# EAGLE schematic Powerboard v1 (EAGLE 9.4.2)
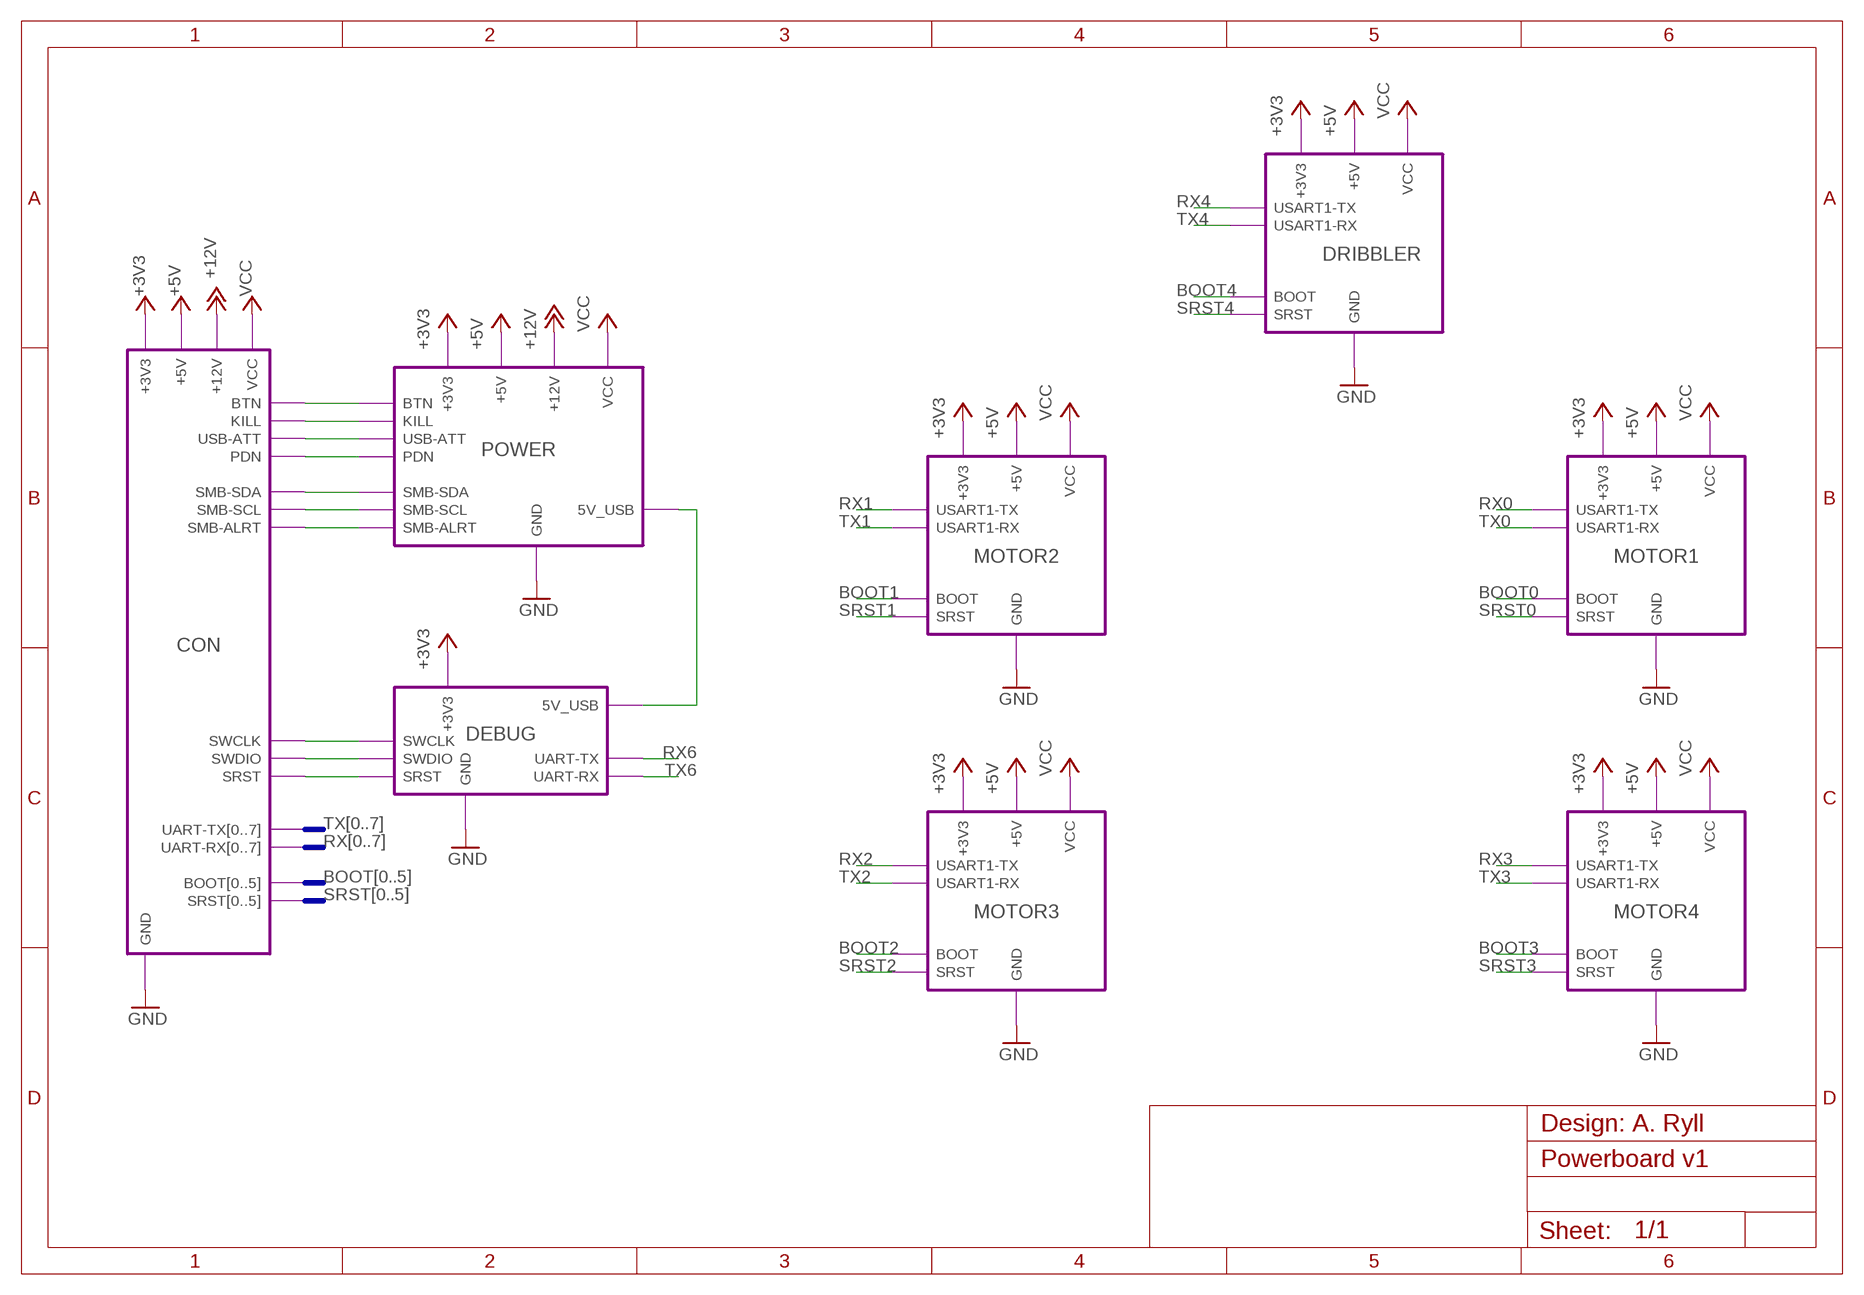
[diagram p0: schematic, sheet 1]

## Module instances
POWER = POWER
DEBUG = DEBUG
MOTOR1 = MOTOR
MOTOR2 = MOTOR
CON = CON
MOTOR3 = MOTOR
MOTOR4 = MOTOR
DRIBBLER = DRIBBLER

## Nets
5V_USB: port POWER.5V_USB DEBUG.5V_USB
+3V3: port POWER.+3V3 MOTOR2.+3V3 MOTOR3.+3V3 MOTOR1.+3V3 MOTOR4.+3V3 DRIBBLER.+3V3 DEBUG.+3V3 CON.+3V3
+5V: port POWER.+5V MOTOR2.+5V MOTOR3.+5V MOTOR1.+5V MOTOR4.+5V DRIBBLER.+5V CON.+5V
+12V: port POWER.+12V CON.+12V
BOOT0: port MOTOR1.BOOT
BOOT1: port MOTOR2.BOOT
BOOT2: port MOTOR3.BOOT
BOOT3: port MOTOR4.BOOT
BOOT4: port DRIBBLER.BOOT
BTN: port CON.BTN POWER.BTN
GND: port CON.GND POWER.GND MOTOR1.GND MOTOR2.GND MOTOR3.GND MOTOR4.GND DRIBBLER.GND DEBUG.GND
KILL: port CON.KILL POWER.KILL
PDN: port CON.PDN POWER.PDN
RX0: port MOTOR1.USART1-TX
RX1: port MOTOR2.USART1-TX
RX2: port MOTOR3.USART1-TX
RX3: port MOTOR4.USART1-TX
RX4: port DRIBBLER.USART1-TX
RX6: port DEBUG.UART-TX
SMB-ALRT: port CON.SMB-ALRT POWER.SMB-ALRT
SMB-SCL: port CON.SMB-SCL POWER.SMB-SCL
SMB-SDA: port CON.SMB-SDA POWER.SMB-SDA
SRST: port CON.SRST DEBUG.SRST
SRST0: port MOTOR1.SRST
SRST1: port MOTOR2.SRST
SRST2: port MOTOR3.SRST
SRST3: port MOTOR4.SRST
SRST4: port DRIBBLER.SRST
SWCLK: port CON.SWCLK DEBUG.SWCLK
SWDIO: port CON.SWDIO DEBUG.SWDIO
TX0: port MOTOR1.USART1-RX
TX1: port MOTOR2.USART1-RX
TX2: port MOTOR3.USART1-RX
TX3: port MOTOR4.USART1-RX
TX4: port DRIBBLER.USART1-RX
TX6: port DEBUG.UART-RX
USB-ATT: port CON.USB-ATT POWER.USB-ATT
VCC: port POWER.VCC MOTOR2.VCC MOTOR3.VCC MOTOR1.VCC MOTOR4.VCC DRIBBLER.VCC CON.VCC

## Buses
SRST[0..5]
BOOT[0..5]
TX[0..7]
RX[0..7]

## Notes on the sheet
- Design: A. Ryll

## Library data of the parts

## Module POWER
Ports: SMB-SCL(in) SMB-SDA(io) USB-ATT(out) PDN(out) KILL(in) 5V_USB(pwr) +3V3(pwr) +5V(pwr) +12V(pwr) VCC(pwr) GND(pwr) SMB-ALRT(oc) BTN(in)
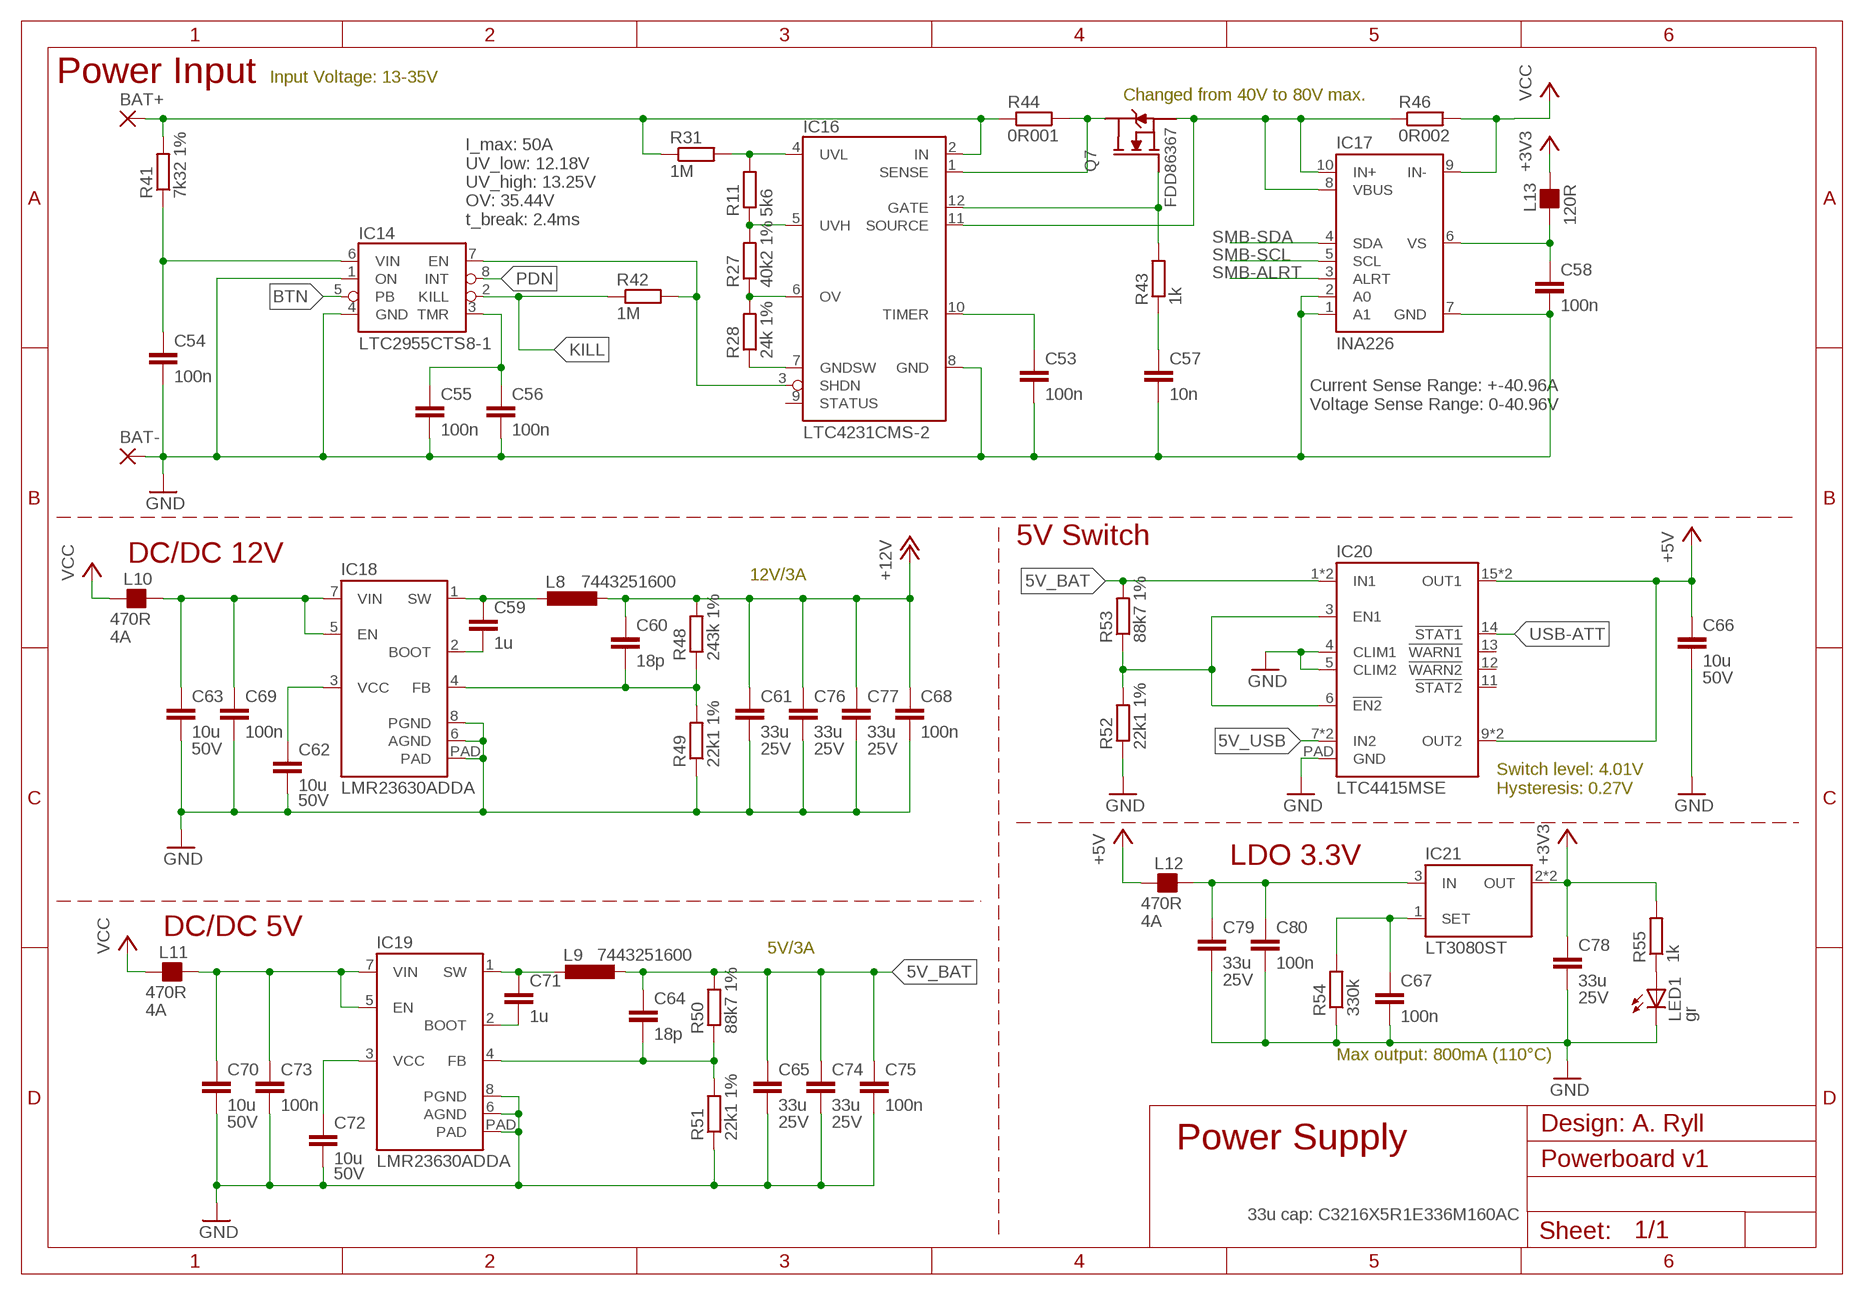
[diagram p1: schematic, module POWER, sheet 1]

### Parts
BAT+  WIREPAD5,08/3  [5,08/3]
BAT-  WIREPAD5,08/3  [5,08/3]
C53  100n  C-EUC0603  [C0603]
C54  100n  C-EUC0603  [C0603]
C55  100n  C-EUC0603  [C0603]
C56  100n  C-EUC0603  [C0603]
C57  10n  C-EUC0603  [C0603]
C58  100n  C-EUC0603  [C0603]
C59  1u  C-EUC0603  [C0603]
C60  18p  C-EUC0603  [C0603]
C61  33u  C-EUC1206  [C1206]
C62  10u  C-EUC1206  [C1206]
C63  10u  C-EUC1206  [C1206]
C64  18p  C-EUC0603  [C0603]
C65  33u  C-EUC1206  [C1206]
C66  10u  C-EUC1206  [C1206]
C67  100n  C-EUC0603  [C0603]
C68  100n  C-EUC0603  [C0603]
C69  100n  C-EUC0603  [C0603]
C70  10u  C-EUC1206  [C1206]
C71  1u  C-EUC0603  [C0603]
C72  10u  C-EUC1206  [C1206]
C73  100n  C-EUC0603  [C0603]
C74  33u  C-EUC1206  [C1206]
C75  100n  C-EUC0603  [C0603]
C76  33u  C-EUC1206  [C1206]
C77  33u  C-EUC1206  [C1206]
C78  33u  C-EUC1206  [C1206]
C79  33u  C-EUC1206  [C1206]
C80  100n  C-EUC0603  [C0603]
IC14  LTC2955CTS8-1  LTC2955  [SOT23-8]
IC16  LTC4231CMS-2  LTC4231  [MSOP-12]
IC17  INA226  [DGS_S-PDSO-G10]
IC18  LMR23630ADDA  LMR23630_DDA  [DDA_R-PDSO-G8]
IC19  LMR23630ADDA  LMR23630_DDA  [DDA_R-PDSO-G8]
IC20  LTC4415MSE  [MSOP-16P]
IC21  LT3080ST  [SOT223]
L8  7443251600  LHCI  [WE-HCI]
L9  7443251600  LHCI  [WE-HCI]
L10  470R  FB_1206  [L1206]
L11  470R  FB_1206  [L1206]
L12  470R  FB_1206  [L1206]
L13  120R  FB_0603  [L0603]
LED1  gr  LEDCHIP-LED0603  [CHIP-LED0603]
Q7  FDD86367  NMOSDPAK  [D-PAK_TO252AA]
R11  5k6  R-EU_R0603  [R0603]
R27  40k2 1%  R-EU_R0603  [R0603]
R28  24k 1%  R-EU_R0603  [R0603]
R31  1M  R-EU_R0603  [R0603]
R41  7k32 1%  R-EU_R0603  [R0603]
R42  1M  R-EU_R0603  [R0603]
R43  1k  R-EU_R0603  [R0603]
R44  0R001  R-EU_R2512  [R2512]
R46  0R002  R-EU_R2512  [R2512]
R48  243k 1%  R-EU_R0603  [R0603]
R49  22k1 1%  R-EU_R0603  [R0603]
R50  88k7 1%  R-EU_R0603  [R0603]
R51  22k1 1%  R-EU_R0603  [R0603]
R52  22k1 1%  R-EU_R0603  [R0603]
R53  88k7 1%  R-EU_R0603  [R0603]
R54  330k  R-EU_R0603  [R0603]
R55  1k  R-EU_R0603  [R0603]

### Nets
5V_BAT: C64.1 C65.1 C74.1 C75.1 IC20.1(IN1) IC20.2(IN1) L9.1 R50.2 R53.2
5V_USB: IC20.7(IN2) IC20.8(IN2)
+3V3: C78.1 IC21.2(OUT) IC21.4(OUT) L13.2 R55.2
+5V: C66.1 IC20.9(OUT2) IC20.10(OUT2) IC20.15(OUT1) IC20.16(OUT1) L12.1
+12V: C60.1 C61.1 C68.1 C76.1 C77.1 L8.1 R48.2
BTN: IC14.5(PB)
GND: BAT-.P$1(P) C53.2 C54.2 C55.2 C56.2 C57.2 C58.2 C61.2 C62.2 C63.2 C65.2 C66.2 C67.2 C68.2 C69.2 C70.2 C72.2 C73.2 C74.2 C75.2 C76.2 C77.2 C78.2 C79.2 C80.2 IC14.1(ON) IC14.4(GND) IC16.8(GND) IC17.1(A1) IC17.2(A0) IC17.7(GND) IC18.6(AGND) IC18.8(PGND) IC18.PAD IC19.6(AGND) IC19.8(PGND) IC19.PAD IC20.4(CLIM1) IC20.5(CLIM2) IC20.PAD(GND) LED1.C R49.1 R51.1 R52.1 R54.1
KILL: IC14.2(KILL) R42.1
N$33: C53.1 IC16.10(TIMER)
N$73: IC16.5(UVH) R11.1 R27.2
N$74: IC16.6(OV) R27.1 R28.2
N$75: IC16.4(UVL) R11.2 R31.2
N$76: IC16.7(GNDSW) R28.1
N$77: C54.1 IC14.6(VIN) R41.1
N$79: C55.1 C56.1 IC14.3(TMR)
N$80: IC14.7(EN) IC16.3(SHDN) R42.2
N$81: C57.1 R43.1
N$82: IC16.1(SENSE) Q7.4(D) R44.2
N$83: IC16.12(GATE) Q7.1(G) R43.2
N$84: IC16.11(SOURCE) IC17.8(VBUS) IC17.10(IN+) Q7.3(S) R46.1
N$98: C62.1 IC18.3(VCC)
N$99: C59.1 IC18.1(SW) L8.2
N$100: C60.2 IC18.4(FB) R48.1 R49.2
N$101: C59.2 IC18.2(BOOT)
N$102: C72.1 IC19.3(VCC)
N$103: C71.1 IC19.1(SW) L9.2
N$104: C64.2 IC19.4(FB) R50.1 R51.2
N$105: C71.2 IC19.2(BOOT)
N$106: IC20.3(EN1) IC20.6(!EN2) R52.2 R53.1
N$107: C67.1 IC21.1(SET) R54.2
N$108: LED1.A R55.1
N$109: C63.1 C69.1 IC18.5(EN) IC18.7(VIN) L10.2
N$110: C70.1 C73.1 IC19.5(EN) IC19.7(VIN) L11.2
N$111: C79.1 C80.1 IC21.3(IN) L12.2
N$112: C58.1 IC17.6(VS) L13.1
PDN: IC14.8(INT)
SMB-ALRT: IC17.3(ALRT)
SMB-SCL: IC17.5(SCL)
SMB-SDA: IC17.4(SDA)
USB-ATT: IC20.14(!STAT1)
V_BAT: BAT+.P$1(P) IC16.2(IN) R31.1 R41.2 R44.1
VCC: IC17.9(IN-) L10.1 L11.1 R46.2
Unconnected: IC16.9(STATUS) IC20.11(!STAT2) IC20.12(!WARN2) IC20.13(!WARN1)

### Notes on the sheet
- Power Input | Input Voltage: 13-35V
- Changed from 40V to 80V max.
- I_max: 50A
  UV_low: 12.18V
  UV_high: 13.25V
  OV: 35.44V
  t_break: 2.4ms
- Current Sense Range: +-40.96A
  Voltage Sense Range: 0-40.96V
- 5V Switch
- DC/DC 12V
- 12V/3A
- Switch level: 4.01V
  Hysteresis: 0.27V
- LDO 3.3V
- DC/DC 5V
- 5V/3A
- Max output: 800mA (110°C)
- Design: A. Ryll
- Power Supply
- 33u cap: C3216X5R1E336M160AC

### Library data of the parts
BAT+ BAT- = TIGERs:WIREPAD: Wire PAD connect wire on PCB
C53-C60 C64 C67-C69 C71 C73 C75 C80 = rcl:C-EU: CAPACITOR, European symbol; SPICEPREFIX: C
C61 C65 C74 C76-C79 = rcl:C-EU: CAPACITOR, European symbol; SPICEPREFIX: C; VOLTAGE: 25V
C62 C63 C66 C70 C72 = rcl:C-EU: CAPACITOR, European symbol; SPICEPREFIX: C; VOLTAGE: 50V
IC14 = TIGERs:LTC2955: Pushbutton On/Off Controller with Automatic Turn-On
IC16 = TIGERs:LTC4231: Micropower Hot Swap Controller
IC17 = TIGERs:INA226
IC18 IC19 = TIGERs:LMR23630_DDA
IC20 = TIGERs:LTC4415
IC21 = TIGERs:LT3080ST
L8 L9 = TIGERs:L
L10-L12 = rc-master-smd:FB_: FERRITE BEAD; IMAX: 4A
L13 = rc-master-smd:FB_: FERRITE BEAD
LED1 = led:LED: LED OSRAM: - CHIPLED LG R971, LG N971, LY N971, LG Q971, LY Q971, LO R971, LY R971 LH N974, LH R974 LS Q976, LO Q976, LY Q976 LO Q996 - Hyper CHIPLED LW Q18S LB Q993, LB Q99A, LB R99A - SideLED LS A670, LO A670, LY A670, LG A670, LP A670 LB A673, LV A673, LT A673, LW A673 LH A674 LY A675 LS A676, LA A676, LO A676, LY A676, LW A676 LS A679, LY A679, LG A679 - Hyper Micro SIDELED® LS Y876, LA Y876, LO Y876, LY Y876 LT Y87S - SmartLED LW L88C, LW L88S LB L89C, LB L89S, LG L890 LS L89K, LO L89K, LY L89K LS L896, LA L896, LO L896, LY L896 - TOPLED LS T670, LO T670, LY T670, LG T670, LP T670 LSG T670, LSP T670, LSY T670, LOP T670, LYG T670 LG T671, LOG T671, LSG T671 LB T673, LV T673, LT T673, LW T673 LH T674 LS T676, LA T676, LO T676, LY T676, LB T676, LH T676, LSB T676, LW T676 LB T67C, LV T67C, LT T67C, LS T67K, LO T67K, LY T67K, LW E67C LS E67B, LA E67B, LO E67B, LY E67B, LB E67C, LV E67C, LT E67C LW T67C LS T679, LY T679, LG T679 LS T770, LO T770, LY T770, LG T770, LP T770 LB T773, LV T773, LT T773, LW T773 LH T774 LS E675, LA E675, LY E675, LS T675 LS T776, LA T776, LO T776, LY T776, LB T776 LHGB T686 LT T68C, LB T68C - Hyper Mini TOPLED® LB M676 - Mini TOPLED Santana® LG M470 LS M47K, LO M47K, LY M47K Source: http://www.osram.convergy.de LUXEON: - LUMILED® LXK2-PW12-R00, LXK2-PW12-S00, LXK2-PW14-U00, LXK2-PW14-V00 LXK2-PM12-R00, LXK2-PM12-S00, LXK2-PM14-U00 LXK2-PE12-Q00, LXK2-PE12-R00, LXK2-PE12-S00, LXK2-PE14-T00, LXK2-PE14-U00 LXK2-PB12-K00, LXK2-PB12-L00, LXK2-PB12-M00, LXK2-PB14-N00, LXK2-PB14-P00, LXK2-PB14-Q00 LXK2-PR12-L00, LXK2-PR12-M00, LXK2-PR14-Q00, LXK2-PR14-R00 LXK2-PD12-Q00, LXK2-PD12-R00, LXK2-PD12-S00 LXK2-PH12-R00, LXK2-PH12-S00 LXK2-PL12-P00, LXK2-PL12-Q00, LXK2-PL12-R00 Source: www.luxeon.com KINGBRIGHT: KA-3528ASYC Source: www.kingbright.com
Q7 = TIGERs:NMOS
R11 R27 R28 R31 R41-R44 R46 R48-R55 = rcl:R-EU_: RESISTOR, European symbol; SPICEPREFIX: R

## Module DEBUG
Ports: 5V_USB(pwr) UART-TX(out) UART-RX(in) SRST(out) +3V3(pwr) GND(pwr) SWDIO(io) SWCLK(out)
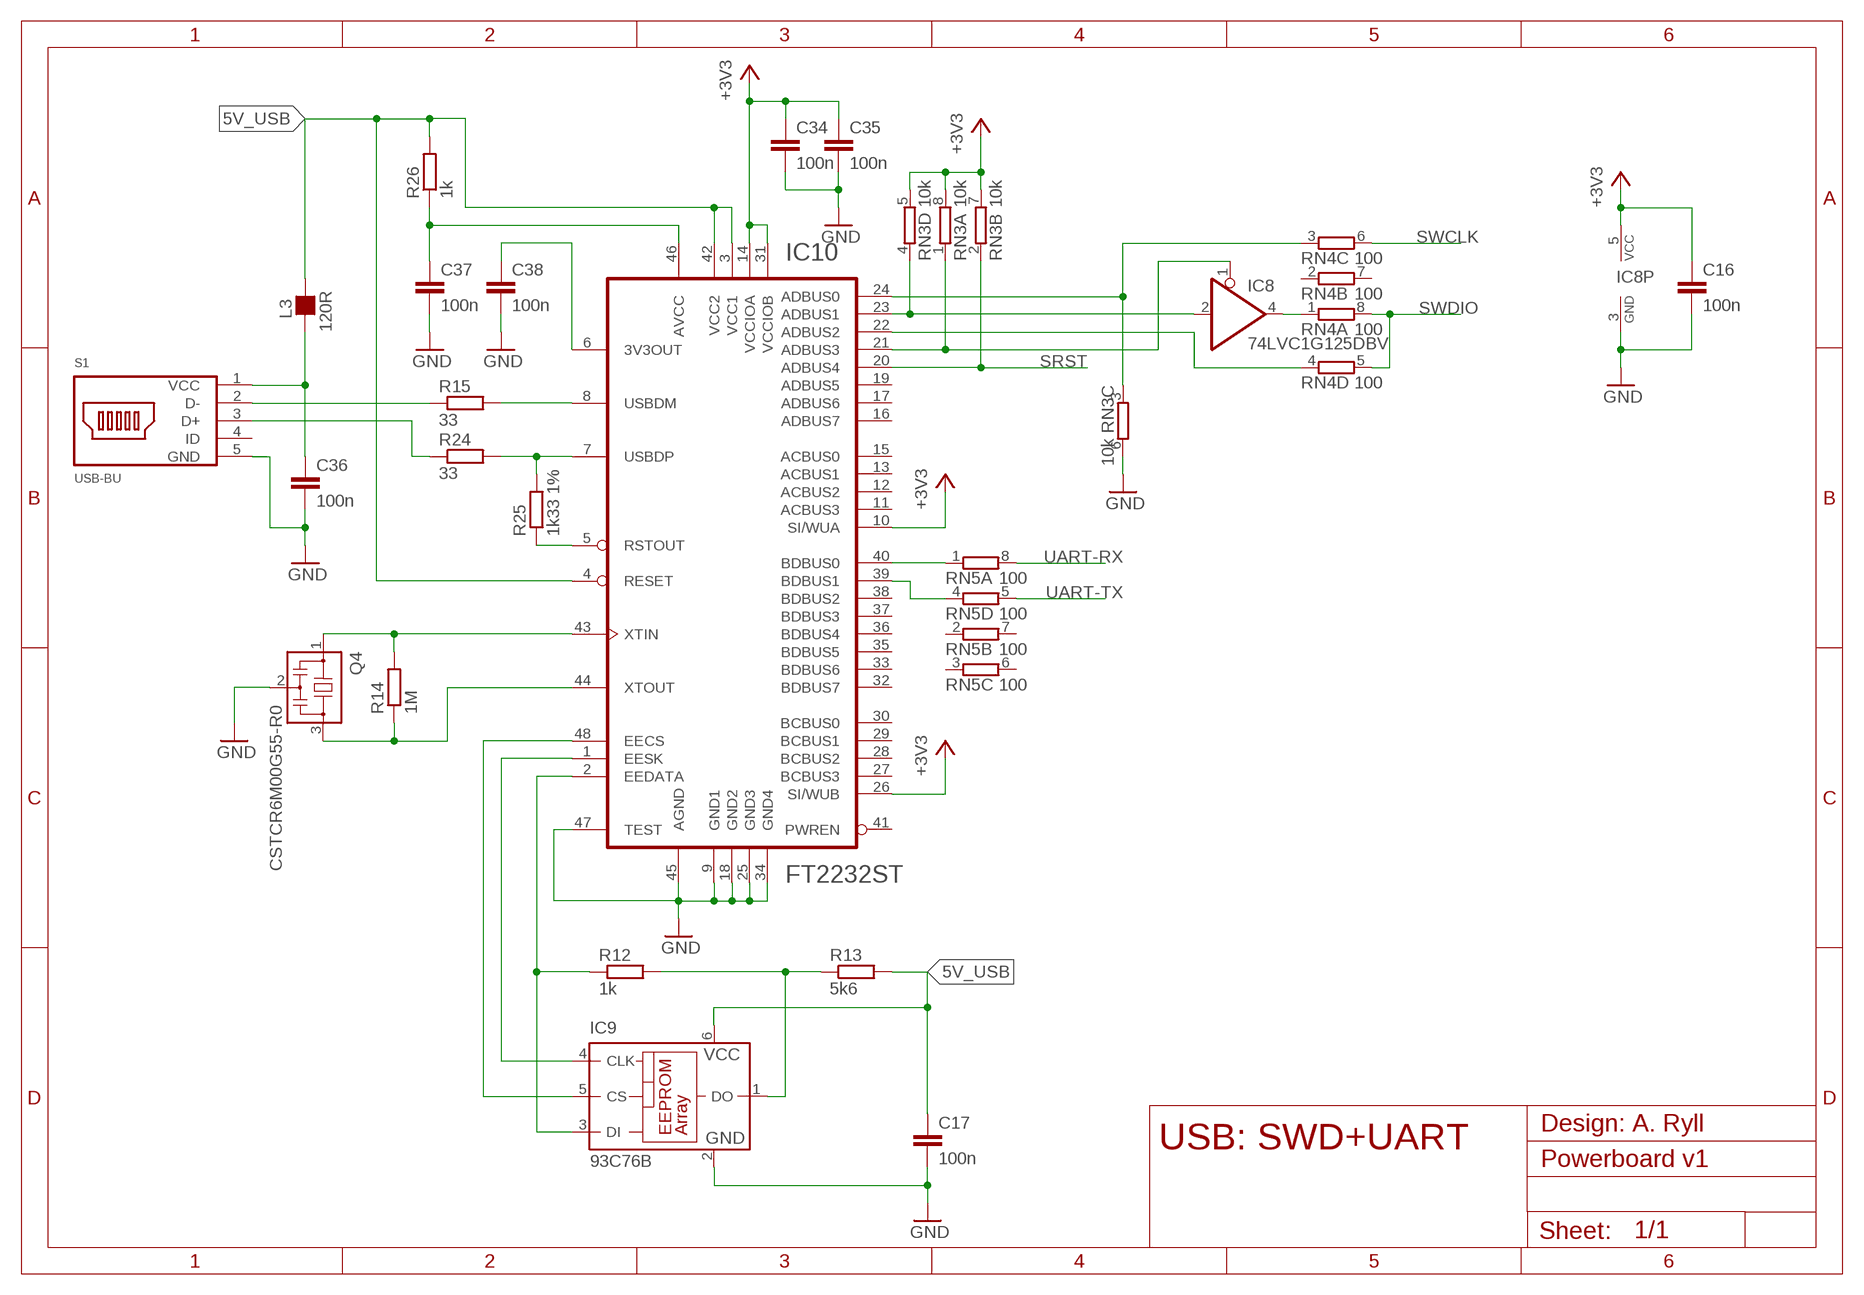
[diagram p2: schematic, module DEBUG, sheet 1]

### Parts
C16  100n  C-EUC0603  [C0603]
C17  100n  C-EUC0603  [C0603]
C34  100n  C-EUC0603  [C0603]
C35  100n  C-EUC0603  [C0603]
C36  100n  C-EUC0603  [C0603]
C37  100n  C-EUC0603  [C0603]
C38  100n  C-EUC0603  [C0603]
IC8  74LVC1G125DBV  [SOT23-5]
IC9  93C76B  [SOT23-6]
IC10  FT2232ST  [LQFP48-ST]
L3  120R  FB_0603  [L0603]
Q4  CSTCR6M00G55-R0  CSTCR6M00G53Z  [CSTCR6M]
R12  1k  R-EU_R0603  [R0603]
R13  5k6  R-EU_R0603  [R0603]
R14  1M  R-EU_R0603  [R0603]
R15  33  R-EU_R0603  [R0603]
R24  33  R-EU_R0603  [R0603]
R25  1k33 1%  R-EU_R0603  [R0603]
R26  1k  R-EU_R0603  [R0603]
RN3  10k  4R-NEXB28V  [EXB28V]
RN4  100  4R-NEXB28V  [EXB28V]
RN5  100  4R-NEXB28V  [EXB28V]
S1  USB-BU  [USB-BMICRO]

### Nets
5V_USB: C17.1 IC9.6(VCC) IC10.3(VCC1) IC10.4(RESET) IC10.42(VCC2) L3.2 R13.2 R26.2
+3V3: C16.1 C34.1 C35.1 IC8.5(VCC) IC10.10(SI/WUA) IC10.14(VCCIOA) IC10.26(SI/WUB) IC10.31(VCCIOB) RN3.5 RN3.7 RN3.8
EECS: IC9.5(CS) IC10.48(EECS)
EEDATA: IC9.3(DI) IC10.2(EEDATA) R12.1
EESK: IC9.4(CLK) IC10.1(EESK)
GND: C16.2 C17.2 C34.2 C35.2 C36.2 C37.2 C38.2 IC8.3(GND) IC9.2(GND) IC10.9(GND1) IC10.18(GND2) IC10.25(GND3) IC10.34(GND4) IC10.45(AGND) IC10.47(TEST) Q4.2 RN3.6 S1.5(GND)
N$61: IC9.1(DO) R12.2 R13.1
N$62: IC10.43(XTIN) Q4.1 R14.2
N$63: IC10.40(BDBUS0) RN5.1
N$64: IC10.44(XTOUT) Q4.3 R14.1
N$71: IC10.8(USBDM) R15.2
N$72: IC10.7(USBDP) R24.2 R25.2
N$85: R15.1 S1.2(D-)
N$86: R24.1 S1.3(D+)
N$87: IC10.5(RSTOUT) R25.1
N$88: C37.1 IC10.46(AVCC) R26.1
N$89: IC10.24(ADBUS0) RN3.3 RN4.3
N$90: C36.1 L3.1 S1.1(VCC)
N$91: IC8.2(I) IC10.23(ADBUS1) RN3.4
N$92: IC8.4(O) RN4.1
N$93: IC10.39(BDBUS1) RN5.4
N$94: IC10.22(ADBUS2) RN4.4
N$95: IC8.1(OE) IC10.21(ADBUS3) RN3.1
N$96: C38.1 IC10.6(3V3OUT)
SRST: IC10.20(ADBUS4) RN3.2
SWCLK: RN4.6
SWDIO: RN4.5 RN4.8
UART-RX: RN5.8
UART-TX: RN5.5
Unconnected: IC10.11(ACBUS3) IC10.12(ACBUS2) IC10.13(ACBUS1) IC10.15(ACBUS0) IC10.16(ADBUS7) IC10.17(ADBUS6) IC10.19(ADBUS5) IC10.27(BCBUS3) IC10.28(BCBUS2) IC10.29(BCBUS1) IC10.30(BCBUS0) IC10.32(BDBUS7) IC10.33(BDBUS6) IC10.35(BDBUS5) IC10.36(BDBUS4) IC10.37(BDBUS3) IC10.38(BDBUS2) IC10.41(PWREN) RN4.2 RN4.7 RN5.2 RN5.3 RN5.6 RN5.7 S1.4(ID)

### Notes on the sheet
- Design: A. Ryll
- USB: SWD+UART

### Library data of the parts
C16 C17 C34-C38 = rcl:C-EU: CAPACITOR, European symbol; SPICEPREFIX: C
IC8 = 74xx-little-de:74*1G125: Single Bus Buffer Gate with 3-State Output
IC9 = microchip:93*76?: 8K Microwire Compatible Serial EEPROM Source: http://ww1.microchip.com/downloads/en/DeviceDoc/21796H.pdf; OC_FARNELL: unknown; OC_NEWARK: unknown
IC10 = TIGERs:FT2232
L3 = rc-master-smd:FB_: FERRITE BEAD
Q4 = TIGERs:CSTCR: Resonator Source: murata.co.jp; MPN: CSTCR6M00G53-R0; OC_FARNELL: 1170434; OC_NEWARK: 25M8759
R12-R15 R24-R26 = rcl:R-EU_: RESISTOR, European symbol; SPICEPREFIX: R
RN3-RN5 = resistor-dil:4R-N: Array Chip Resistor Source: RS Component / Phycomp; OC_FARNELL: unknown; OC_NEWARK: unknown
S1 = TIGERs:USB-B: USB Connector Micro: Molex 47346-0001

## Module MOTOR
Ports: USART1-TX(out) USART1-RX(in) BOOT(in) +3V3(oc) +5V(pwr) GND(oc) VCC(pwr) SRST(oc)
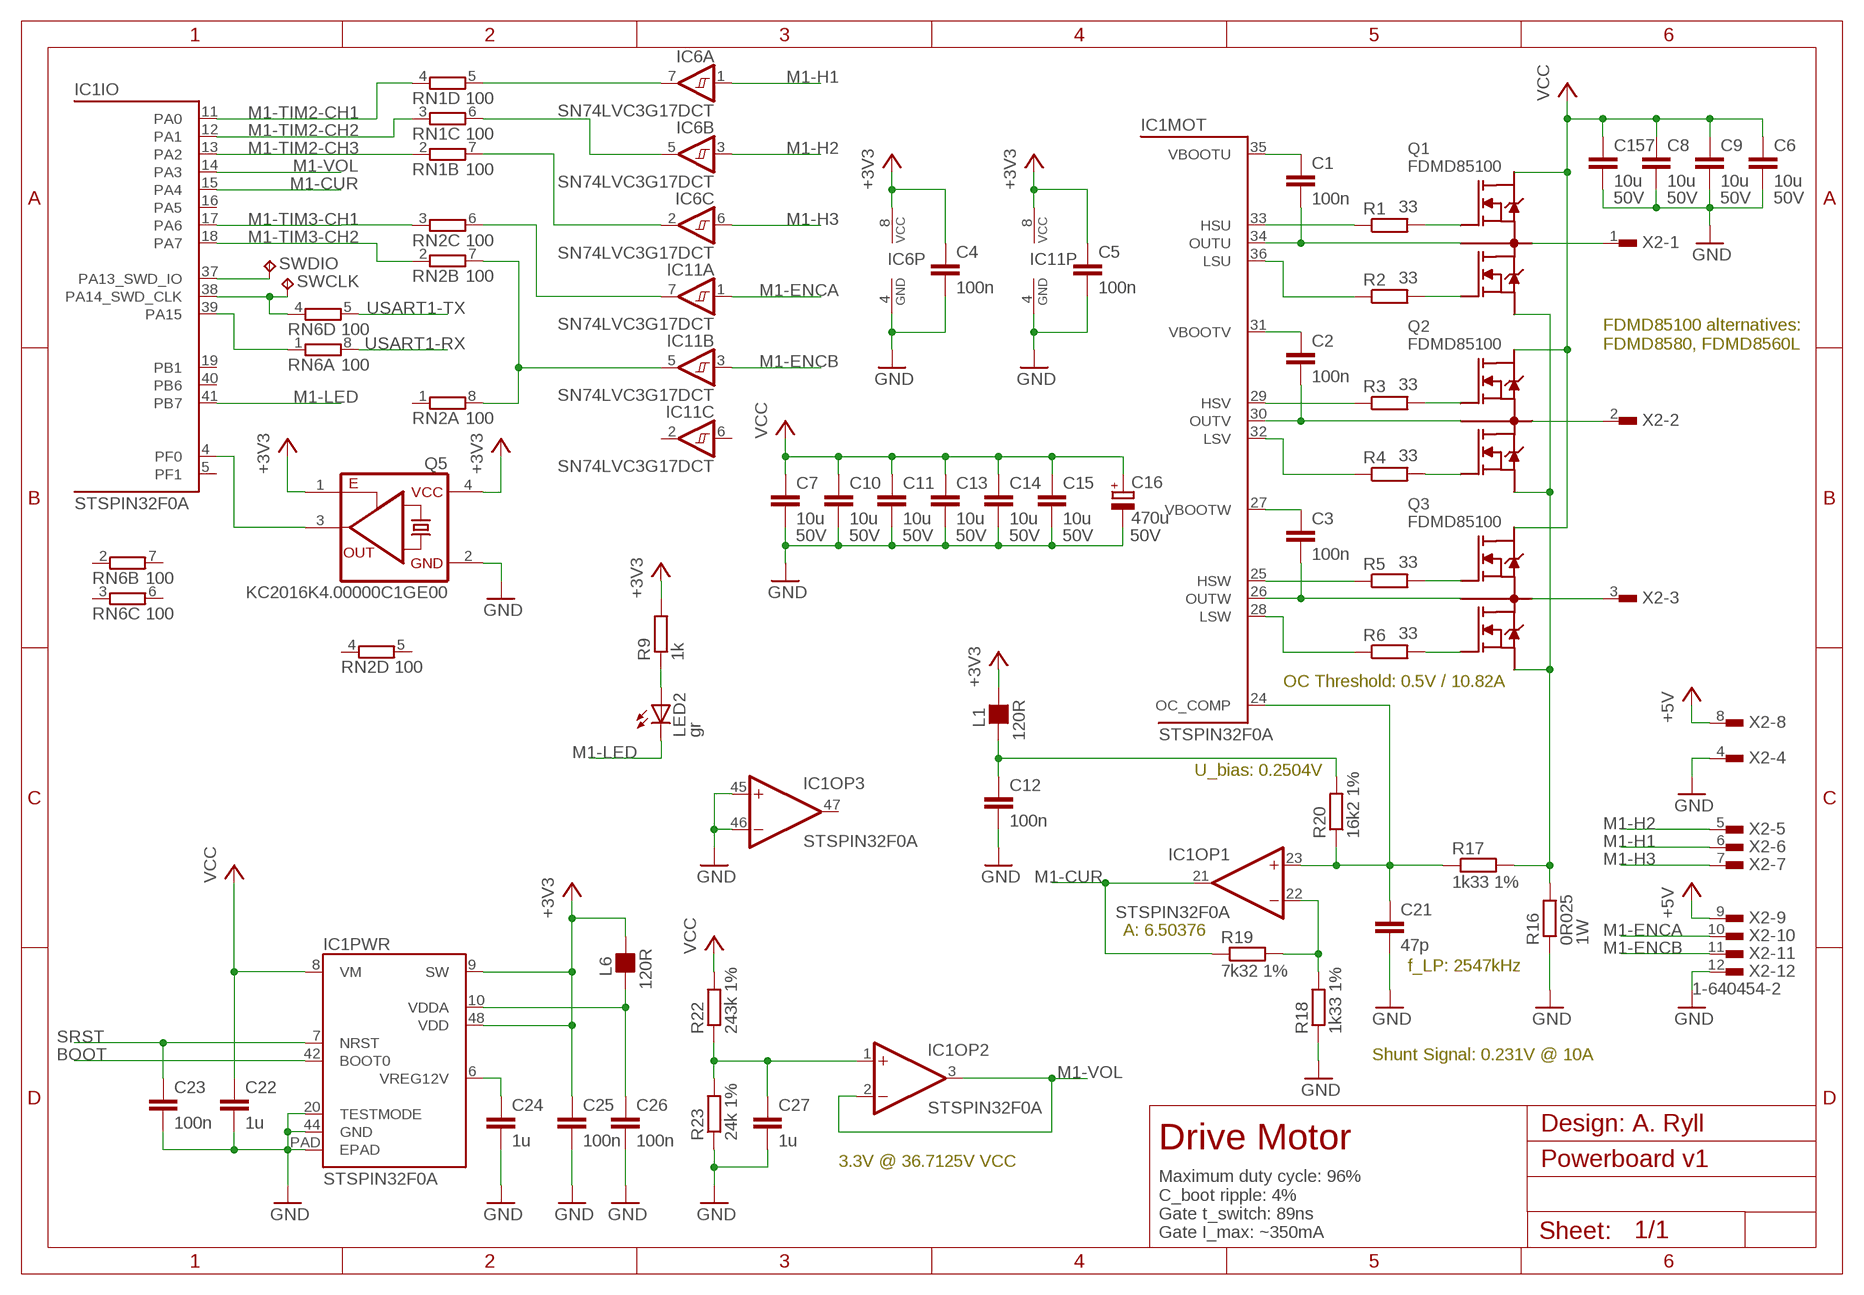
[diagram p3: schematic, module MOTOR, sheet 1]

### Parts
C1  100n  C-EUC0603  [C0603]
C2  100n  C-EUC0603  [C0603]
C3  100n  C-EUC0603  [C0603]
C4  100n  C-EUC0603  [C0603]
C5  100n  C-EUC0603  [C0603]
C6  10u  C-EUC1206  [C1206]
C7  10u  C-EUC1206  [C1206]
C8  10u  C-EUC1206  [C1206]
C9  10u  C-EUC1206  [C1206]
C10  10u  C-EUC1206  [C1206]
C11  10u  C-EUC1206  [C1206]
C12  100n  C-EUC0603  [C0603]
C13  10u  C-EUC1206  [C1206]
C14  10u  C-EUC1206  [C1206]
C15  10u  C-EUC1206  [C1206]
C16  470u  CPOL-EUFM  [C22-12.5L]
C21  47p  C-EUC0603  [C0603]
C22  1u  C-EUC0603  [C0603]
C23  100n  C-EUC0603  [C0603]
C24  1u  C-EUC0603  [C0603]
C25  100n  C-EUC0603  [C0603]
C26  100n  C-EUC0603  [C0603]
C27  1u  C-EUC0603  [C0603]
C157  10u  C-EUC1206  [C1206]
IC1  STSPIN32F0A  [VFQFPN48]
IC6  SN74LVC3G17DCT  743G17DCT  [DCT_R-PDSO-G8]
IC11  SN74LVC3G17DCT  743G17DCT  [DCT_R-PDSO-G8]
L1  120R  FB_0603  [L0603]
L6  120R  FB_0603  [L0603]
LED2  gr  LEDCHIP-LED0603  [CHIP-LED0603]
Q1  FDMD85100  NMOS_HBRIDGE  [POWER56_HBRIDGE]
Q2  FDMD85100  NMOS_HBRIDGE  [POWER56_HBRIDGE]
Q3  FDMD85100  NMOS_HBRIDGE  [POWER56_HBRIDGE]
Q5  KC2016K4.00000C1GE00  OSCIKC2016  [OSCI-KC2016]
R1  33  R-EU_R0603  [R0603]
R2  33  R-EU_R0603  [R0603]
R3  33  R-EU_R0603  [R0603]
R4  33  R-EU_R0603  [R0603]
R5  33  R-EU_R0603  [R0603]
R6  33  R-EU_R0603  [R0603]
R9  1k  R-EU_R0603  [R0603]
R16  0R025  R-EU_R1206  [R1206]
R17  1k33 1%  R-EU_R0603  [R0603]
R18  1k33 1%  R-EU_R0603  [R0603]
R19  7k32 1%  R-EU_R0603  [R0603]
R20  16k2 1%  R-EU_R0603  [R0603]
R22  243k 1%  R-EU_R0603  [R0603]
R23  24k 1%  R-EU_R0603  [R0603]
RN1  100  4R-NEXB28V  [EXB28V]
RN2  100  4R-NEXB28V  [EXB28V]
RN6  100  4R-NEXB28V  [EXB28V]
SWCLK  TPTP10R  [TP10R]
SWDIO  TPTP10R  [TP10R]
X2  1-640454-2  MTA-100-12  [1-640454-2]

### Nets
+3V3: C4.1 C5.1 C25.1 IC1.9(PWR:SW) IC1.48(PWR:VDD) IC6.8(P:VCC) IC11.8(P:VCC) L1.2 L6.2 Q5.1(OE) Q5.4(VCC) R9.2
+5V: X2.8 X2.9
BOOT: IC1.42(PWR:BOOT0)
GND: C4.2 C5.2 C6.2 C7.2 C8.2 C9.2 C10.2 C11.2 C12.2 C13.2 C14.2 C15.2 C16.- C21.2 C22.2 C23.2 C24.2 C25.2 C26.2 C27.2 C157.2 IC1.20(PWR:TESTMODE) IC1.44(PWR:GND) IC1.45(OP3:+IN) IC1.46(OP3:-IN) IC1.PAD(PWR:EPAD) IC6.4(P:GND) IC11.4(P:GND) Q5.2(GND) R16.1 R18.1 R23.1 X2.4 X2.12
M1-CUR: IC1.15(IO:PA4) IC1.21(OP1:OUT) R19.1
M1-ENCA: IC11.1(A:I) X2.10
M1-ENCB: IC11.3(B:I) X2.11
M1-H1: IC6.1(A:I) X2.6
M1-H2: IC6.3(B:I) X2.5
M1-H3: IC6.6(C:I) X2.7
M1-LED: IC1.41(IO:PB7) LED2.C
M1-TIM2-CH1: IC1.11(IO:PA0) RN1.4
M1-TIM2-CH2: IC1.12(IO:PA1) RN1.3
M1-TIM2-CH3: IC1.13(IO:PA2) RN1.2
M1-TIM3-CH1: IC1.17(IO:PA6) RN2.3
M1-TIM3-CH2: IC1.18(IO:PA7) RN2.2
M1-VOL: IC1.2(OP2:-IN) IC1.3(OP2:OUT) IC1.14(IO:PA3)
MGND: Q1.S2 Q2.S2 Q3.S2 R16.2 R17.2
N$1: C1.2 IC1.34(MOT:OUTU) Q1.2(GR)
N$2: C3.2 IC1.26(MOT:OUTW) Q3.2(GR)
N$3: C2.2 IC1.30(MOT:OUTV) Q2.2(GR)
N$4: Q2.1(G1) R3.2
N$5: Q2.8(G2) R4.2
N$6: Q3.1(G1) R5.2
N$7: Q3.8(G2) R6.2
N$8: Q1.8(G2) R2.2
N$9: Q1.1(G1) R1.2
N$10: IC1.33(MOT:HSU) R1.1
N$11: IC1.36(MOT:LSU) R2.1
N$12: IC1.29(MOT:HSV) R3.1
N$13: IC1.32(MOT:LSV) R4.1
N$14: IC1.25(MOT:HSW) R5.1
N$15: IC1.28(MOT:LSW) R6.1
N$16: C1.1 IC1.35(MOT:VBOOTU)
N$17: C2.1 IC1.31(MOT:VBOOTV)
N$18: C3.1 IC1.27(MOT:VBOOTW)
N$22: IC11.7(A:O) RN2.6
N$23: IC6.7(A:O) RN1.5
N$24: IC6.5(B:O) RN1.6
N$25: IC6.2(C:O) RN1.7
N$26: IC11.5(B:O) RN2.7 RN2.8
N$27: C12.1 L1.1 R20.2
N$29: LED2.A R9.1
N$31: IC1.39(IO:PA15) RN6.1
N$35: C26.1 IC1.10(PWR:VDDA) L6.1
N$39: IC1.22(OP1:-IN) R18.2 R19.2
N$40: C21.1 IC1.23(OP1:+IN) IC1.24(MOT:OC_COMP) R17.1 R20.1
N$43: C24.1 IC1.6(PWR:VREG12V)
N$45: C27.1 IC1.1(OP2:+IN) R22.1 R23.2
N$47: IC1.4(IO:PF0) Q5.3(FO)
SRST: C23.1 IC1.7(PWR:NRST)
SWDCLK: IC1.38(IO:PA14_SWD_CLK) RN6.4 SWCLK.TP
SWDIO: IC1.37(IO:PA13_SWD_IO) SWDIO.TP
USART1-RX: RN6.8
USART1-TX: RN6.5
VCC: C6.1 C7.1 C8.1 C9.1 C10.1 C11.1 C13.1 C14.1 C15.1 C16.+ C22.1 C157.1 IC1.8(PWR:VM) Q1.3(D1) Q1.4(D1) Q1.D1 Q2.3(D1) Q2.4(D1) Q2.D1 Q3.3(D1) Q3.4(D1) Q3.D1 R22.2
WU: Q1.5(S1/D2) Q1.6(S1/D2) Q1.7(S1/D2) X2.1
WV: Q2.5(S1/D2) Q2.6(S1/D2) Q2.7(S1/D2) X2.2
WW: Q3.5(S1/D2) Q3.6(S1/D2) Q3.7(S1/D2) X2.3
Unconnected: IC1.5(IO:PF1) IC1.16(IO:PA5) IC1.19(IO:PB1) IC1.40(IO:PB6) IC1.47(OP3:OUT) IC11.2(C:O) IC11.6(C:I) RN1.1 RN1.8 RN2.1 RN2.4 RN2.5 RN6.2 RN6.3 RN6.6 RN6.7

### Notes on the sheet
- FDMD85100 alternatives:
  FDMD8580, FDMD8560L
- OC Threshold: 0.5V / 10.82A
- U_bias: 0.2504V
- A: 6.50376
- f_LP: 2547kHz
- Shunt Signal: 0.231V @ 10A
- Design: A. Ryll
- Drive Motor
- 3.3V @ 36.7125V VCC
- Maximum duty cycle: 96%
  C_boot ripple: 4%
  Gate t_switch: 89ns
  Gate I_max: ~350mA

### Library data of the parts
C1-C5 C12 C21-C27 = rcl:C-EU: CAPACITOR, European symbol; SPICEPREFIX: C
C6-C11 C13-C15 C157 = rcl:C-EU: CAPACITOR, European symbol; PARTNR: C3225X5R1H106M250AB; SPICEPREFIX: C; VMAX: 50V
C16 = TIGERs:CPOL-EU; PARTNR: EEU-FM1H471B; VMAX: 50V
IC1 = TIGERs:STSPIN32F0A
IC6 IC11 = TIGERs:74*3G17
L1 L6 = rc-master-smd:FB_: FERRITE BEAD
LED2 = led:LED: LED OSRAM: - CHIPLED LG R971, LG N971, LY N971, LG Q971, LY Q971, LO R971, LY R971 LH N974, LH R974 LS Q976, LO Q976, LY Q976 LO Q996 - Hyper CHIPLED LW Q18S LB Q993, LB Q99A, LB R99A - SideLED LS A670, LO A670, LY A670, LG A670, LP A670 LB A673, LV A673, LT A673, LW A673 LH A674 LY A675 LS A676, LA A676, LO A676, LY A676, LW A676 LS A679, LY A679, LG A679 - Hyper Micro SIDELED® LS Y876, LA Y876, LO Y876, LY Y876 LT Y87S - SmartLED LW L88C, LW L88S LB L89C, LB L89S, LG L890 LS L89K, LO L89K, LY L89K LS L896, LA L896, LO L896, LY L896 - TOPLED LS T670, LO T670, LY T670, LG T670, LP T670 LSG T670, LSP T670, LSY T670, LOP T670, LYG T670 LG T671, LOG T671, LSG T671 LB T673, LV T673, LT T673, LW T673 LH T674 LS T676, LA T676, LO T676, LY T676, LB T676, LH T676, LSB T676, LW T676 LB T67C, LV T67C, LT T67C, LS T67K, LO T67K, LY T67K, LW E67C LS E67B, LA E67B, LO E67B, LY E67B, LB E67C, LV E67C, LT E67C LW T67C LS T679, LY T679, LG T679 LS T770, LO T770, LY T770, LG T770, LP T770 LB T773, LV T773, LT T773, LW T773 LH T774 LS E675, LA E675, LY E675, LS T675 LS T776, LA T776, LO T776, LY T776, LB T776 LHGB T686 LT T68C, LB T68C - Hyper Mini TOPLED® LB M676 - Mini TOPLED Santana® LG M470 LS M47K, LO M47K, LY M47K Source: http://www.osram.convergy.de LUXEON: - LUMILED® LXK2-PW12-R00, LXK2-PW12-S00, LXK2-PW14-U00, LXK2-PW14-V00 LXK2-PM12-R00, LXK2-PM12-S00, LXK2-PM14-U00 LXK2-PE12-Q00, LXK2-PE12-R00, LXK2-PE12-S00, LXK2-PE14-T00, LXK2-PE14-U00 LXK2-PB12-K00, LXK2-PB12-L00, LXK2-PB12-M00, LXK2-PB14-N00, LXK2-PB14-P00, LXK2-PB14-Q00 LXK2-PR12-L00, LXK2-PR12-M00, LXK2-PR14-Q00, LXK2-PR14-R00 LXK2-PD12-Q00, LXK2-PD12-R00, LXK2-PD12-S00 LXK2-PH12-R00, LXK2-PH12-S00 LXK2-PL12-P00, LXK2-PL12-Q00, LXK2-PL12-R00 Source: www.luxeon.com KINGBRIGHT: KA-3528ASYC Source: www.kingbright.com; SPICEPREFIX: D
Q1-Q3 = TIGERs:NMOS_HBRIDGE
Q5 = TIGERs:OSCI
R1-R6 R9 R17-R20 R22 R23 = rcl:R-EU_: RESISTOR, European symbol; SPICEPREFIX: R
R16 = rcl:R-EU_: RESISTOR, European symbol; POWER: 1W; SPICEPREFIX: R
RN1 RN2 RN6 = resistor-dil:4R-N: Array Chip Resistor Source: RS Component / Phycomp; OC_FARNELL: unknown; OC_NEWARK: unknown
SWCLK SWDIO = testpad:TP: Test pad
X2 = TIGERs:MTA-100-12; MANUFACTURER_PART_NUMBER: 16404542; VENDOR: TE Connectivity

## Module CON
Ports: SMB-SCL(out) SMB-SDA(io) SWCLK(in) SWDIO(io) KILL(out) SRST(in) +5V(pwr) GND(pwr) BOOT[0..5](out) SRST[0..5](out) UART-TX[0..7](out) UART-RX[0..7](in) SMB-ALRT(oc) BTN(io) PDN(io) USB-ATT(io) +12V(pwr) VCC(pwr) +3V3(pwr)
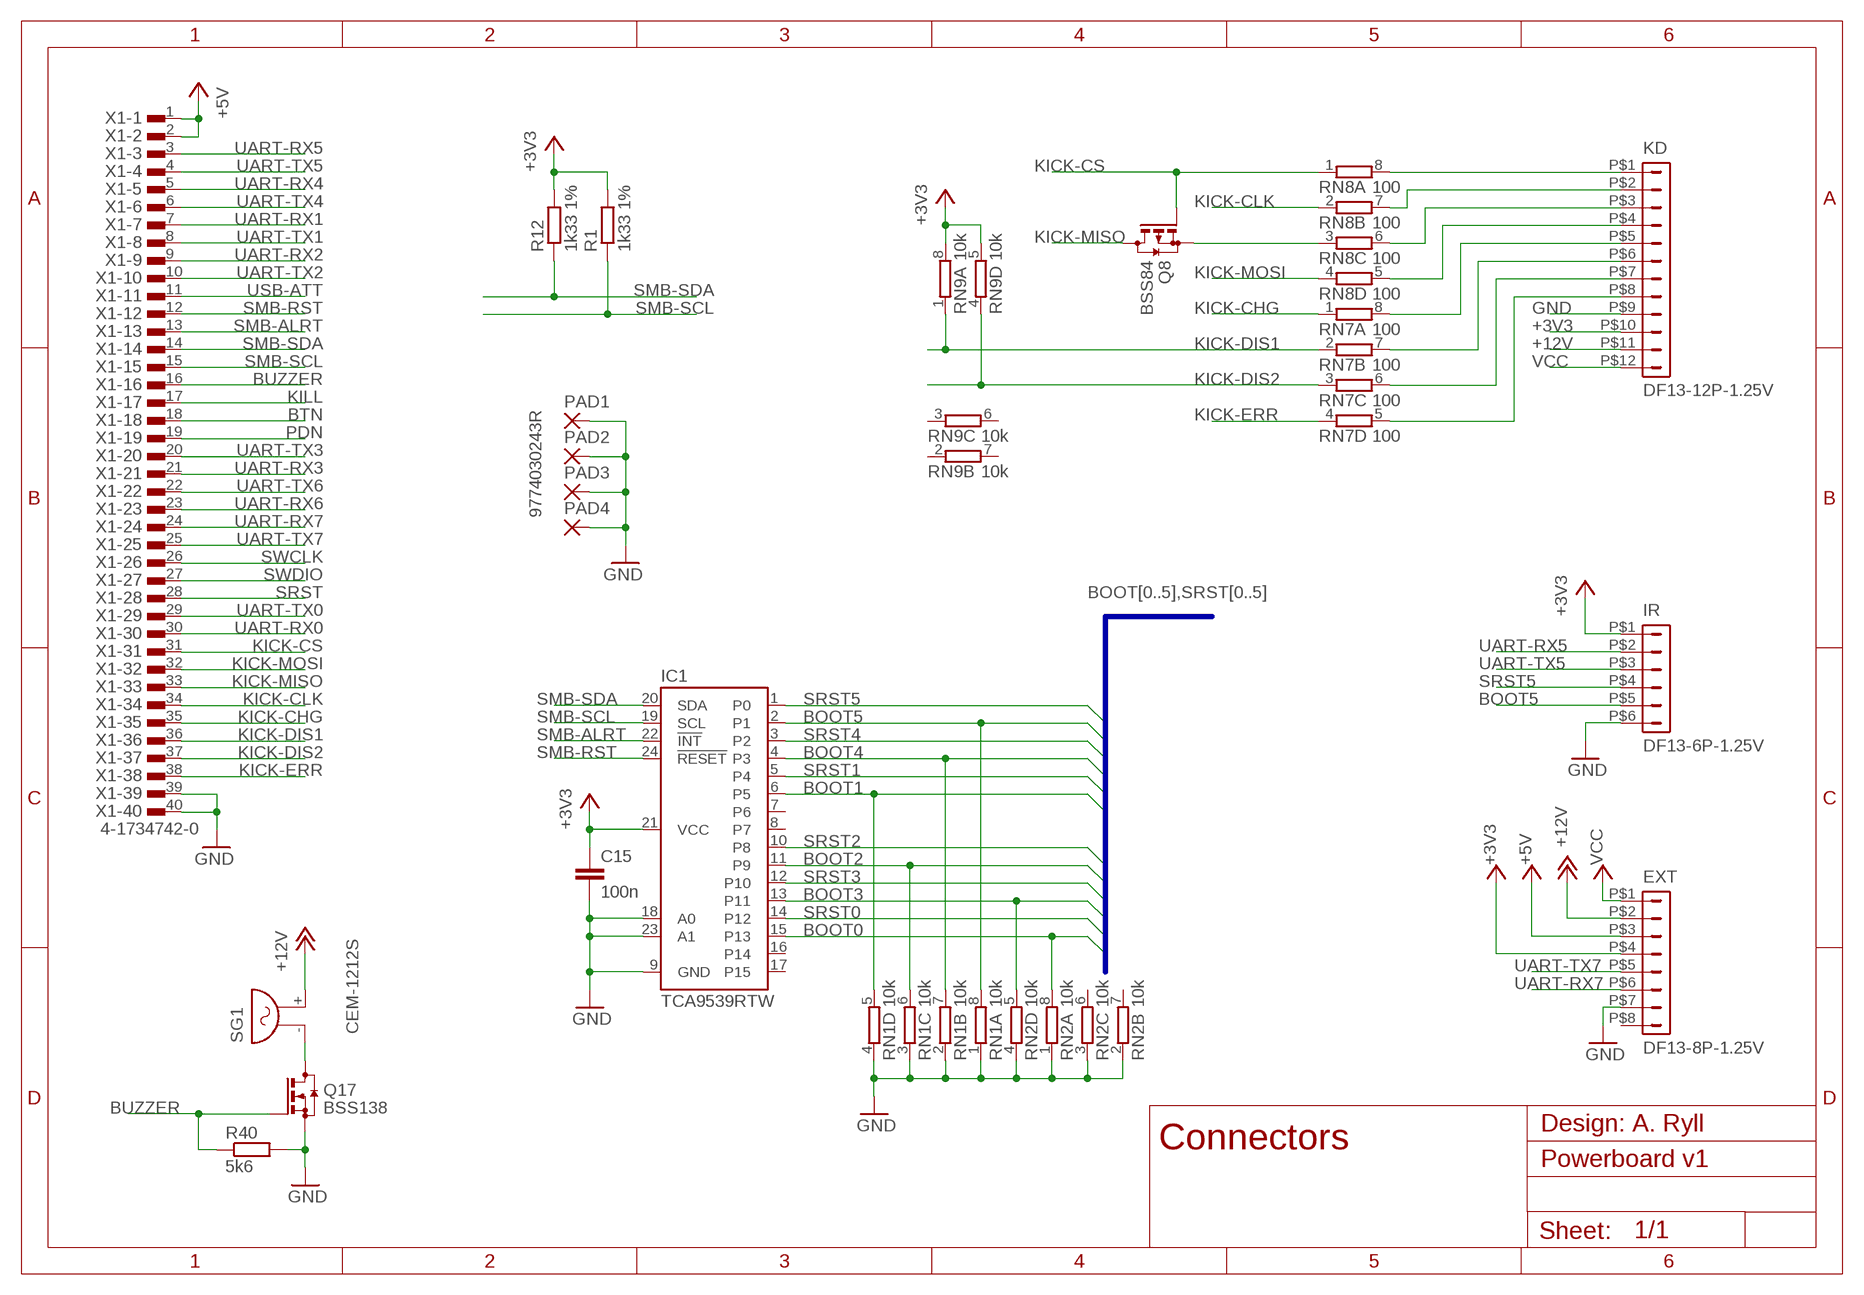
[diagram p4: schematic, module CON, sheet 1]

### Parts
C15  100n  C-EUC0603  [C0603]
EXT  DF13-8P-1.25V  [DF13C-8P-1.25V]
IC1  TCA9539RTW  [WQFN24]
IR  DF13-6P-1.25V  [DF13C-6P-1.25V]
KD  DF13-12P-1.25V  [DF13C-12P-1.25V]
PAD1  WIREPAD5,4/3,0  [5,4/3,0]
PAD2  WIREPAD5,4/3,0  [5,4/3,0]
PAD3  WIREPAD5,4/3,0  [5,4/3,0]
PAD4  9774030243R  WIREPAD5,4/3,0  [5,4/3,0]
Q8  BSS84  [SOT23]
Q17  BSS138  BSS123  [SOT23]
R1  1k33 1%  R-EU_R0603  [R0603]
R12  1k33 1%  R-EU_R0603  [R0603]
R40  5k6  R-EU_R0603  [R0603]
RN1  10k  4R-NEXB28V  [EXB28V]
RN2  10k  4R-NEXB28V  [EXB28V]
RN7  100  4R-NEXB28V  [EXB28V]
RN8  100  4R-NEXB28V  [EXB28V]
RN9  10k  4R-NEXB28V  [EXB28V]
SG1  CEM-1212S  F/QMX  [F/QMX]
X1  4-1734742-0  TE-FPC-0.5MM-40V  [TE-4-1734742-0]

### Nets
+3V3: C15.1 EXT.P$4 IC1.21(VCC) IR.P$1 KD.P$10 R1.2 R12.2 RN9.5 RN9.8
+5V: EXT.P$3 X1.1 X1.2
+12V: EXT.P$2 KD.P$11 SG1.+
BOOT0: IC1.15(P13) RN2.8
BOOT1: IC1.6(P5) RN1.5
BOOT2: IC1.11(P9) RN1.6
BOOT3: IC1.13(P11) RN2.5
BOOT4: IC1.4(P3) RN1.7
BOOT5: IC1.2(P1) IR.P$5 RN1.8
BTN: X1.18
BUZZER: Q17.1(G) R40.1 X1.16
GND: C15.2 EXT.P$7 IC1.9(GND) IC1.18(A0) IC1.23(A1) IR.P$6 KD.P$9 PAD1.1(P) PAD1.2(P) PAD2.1(P) PAD2.2(P) PAD3.1(P) PAD3.2(P) PAD4.1(P) PAD4.2(P) Q17.2(S) R40.2 RN1.1 RN1.2 RN1.3 RN1.4 RN2.1 RN2.2 RN2.3 RN2.4 X1.39 X1.40
KICK-CHG: RN7.1 X1.35
KICK-CLK: RN8.2 X1.34
KICK-CS: Q8.1(G) RN8.1 X1.31
KICK-DIS1: RN7.2 RN9.1 X1.36
KICK-DIS2: RN7.3 RN9.4 X1.37
KICK-ERR: RN7.4 X1.38
KICK-MISO: Q8.3(D) X1.33
KICK-MOSI: RN8.4 X1.32
KILL: X1.17
N$1: Q17.3(D) SG1.-
N$2: Q8.2(S) RN8.3
N$3: KD.P$1 RN8.8
N$4: KD.P$2 RN8.7
N$5: KD.P$3 RN8.6
N$6: KD.P$4 RN8.5
N$7: KD.P$5 RN7.8
N$8: KD.P$6 RN7.7
N$9: KD.P$7 RN7.6
N$10: KD.P$8 RN7.5
PDN: X1.19
SMB-ALRT: IC1.22(!INT) X1.13
SMB-RST: IC1.24(!RESET) X1.12
SMB-SCL: IC1.19(SCL) R1.1 X1.15
SMB-SDA: IC1.20(SDA) R12.1 X1.14
SRST: X1.28
SRST0: IC1.14(P12)
SRST1: IC1.5(P4)
SRST2: IC1.10(P8)
SRST3: IC1.12(P10)
SRST4: IC1.3(P2)
SRST5: IC1.1(P0) IR.P$4
SWCLK: X1.26
SWDIO: X1.27
UART-RX0: X1.30
UART-RX1: X1.7
UART-RX2: X1.9
UART-RX3: X1.21
UART-RX4: X1.5
UART-RX5: IR.P$2 X1.3
UART-RX6: X1.23
UART-RX7: EXT.P$6 X1.24
UART-TX0: X1.29
UART-TX1: X1.8
UART-TX2: X1.10
UART-TX3: X1.20
UART-TX4: X1.6
UART-TX5: IR.P$3 X1.4
UART-TX6: X1.22
UART-TX7: EXT.P$5 X1.25
USB-ATT: X1.11
VCC: EXT.P$1 KD.P$12
Unconnected: EXT.P$8 IC1.7(P6) IC1.8(P7) IC1.16(P14) IC1.17(P15) RN2.6 RN2.7 RN9.2 RN9.3 RN9.6 RN9.7

### Buses
BOOT[0..5],SRST[0..5]

### Notes on the sheet
- Design: A. Ryll
- Connectors

### Library data of the parts
C15 = rcl:C-EU: CAPACITOR, European symbol; SPICEPREFIX: C
EXT = con-hirose-df13:DF13-8P-1.25: DF13-8P 1.25mm Pitch Miniature Crimping Connector.
IC1 = TIGERs:TCA9539
IR = con-hirose-df13:DF13-6P-1.25: DF13-6P 1.25mm Pitch Miniature Crimping Connector.
KD = con-hirose-df13:DF13-12P-1.25: DF13-12P 1.25mm Pitch Miniature Crimping Connector.
PAD1-PAD4 = TIGERs:WIREPAD: Wire PAD connect wire on PCB
Q8 = transistor-small-signal:BSS84: P-CHANNEL MOS FET
Q17 = transistor-small-signal:BSS123: N-CHANNEL MOS FET
R1 R12 R40 = rcl:R-EU_: RESISTOR, European symbol; SPICEPREFIX: R
RN1 RN2 RN7-RN9 = resistor-dil:4R-N: Array Chip Resistor Source: RS Component / Phycomp; OC_FARNELL: unknown; OC_NEWARK: unknown
SG1 = buzzer:F/QMX: BUZZER Source: Buerklin; OC_FARNELL: unknown; OC_NEWARK: unknown
X1 = TIGERs:TE-FPC-0.5MM-40: TE Connectivity 0.5 FPC, ZIF V/T, SMT, 30P Part Numbers: Vertical: 3-1734742-0 Horizontal: 3-1734592-0

## Module DRIBBLER
Ports: +3V3(pwr) +5V(pwr) VCC(pwr) USART1-TX(out) USART1-RX(in) BOOT(in) SRST(oc) GND(oc)
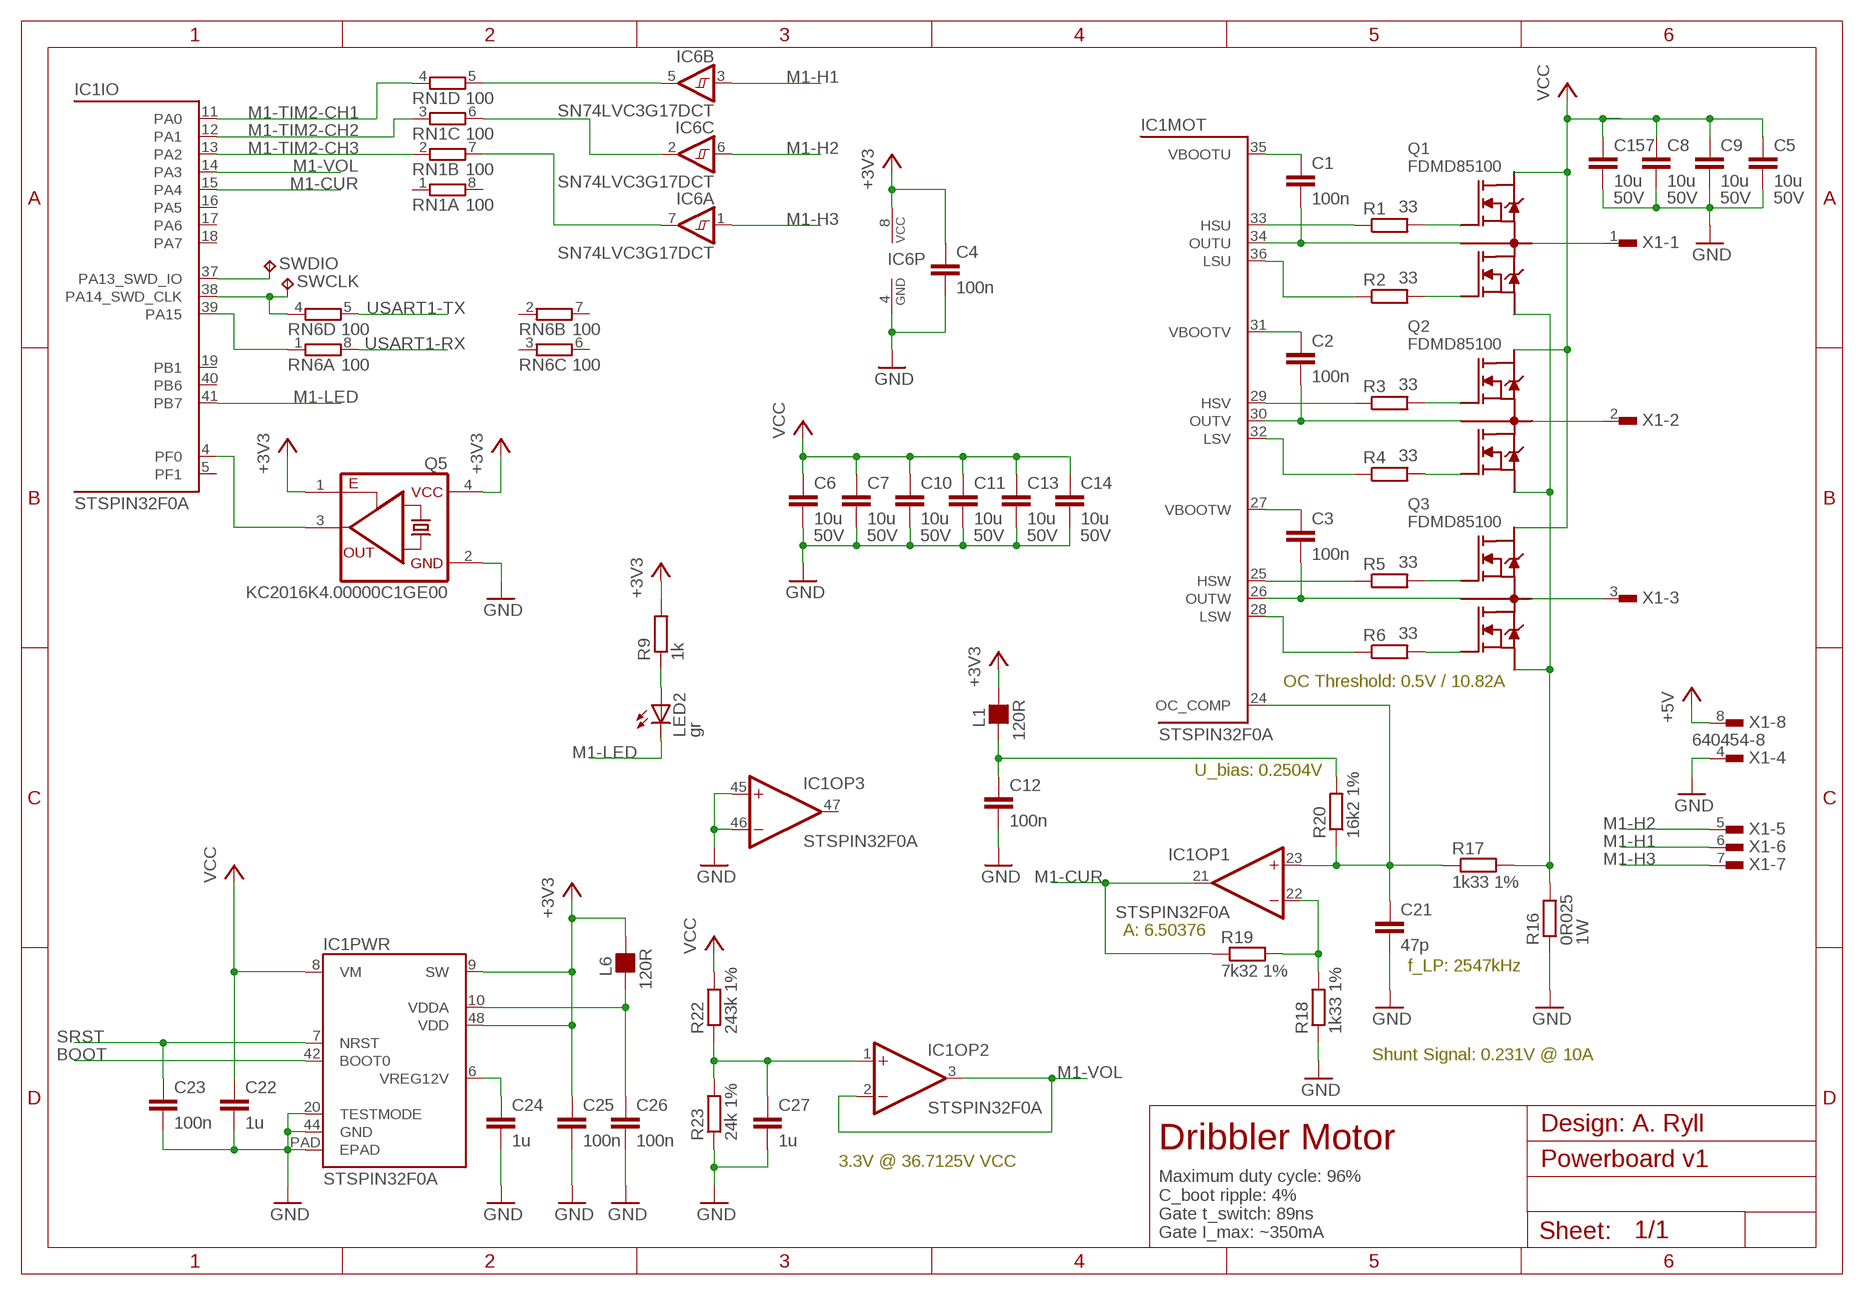
[diagram p5: schematic, module DRIBBLER, sheet 1]

### Parts
C1  100n  C-EUC0603  [C0603]
C2  100n  C-EUC0603  [C0603]
C3  100n  C-EUC0603  [C0603]
C4  100n  C-EUC0603  [C0603]
C5  10u  C-EUC1206  [C1206]
C6  10u  C-EUC1206  [C1206]
C7  10u  C-EUC1206  [C1206]
C8  10u  C-EUC1206  [C1206]
C9  10u  C-EUC1206  [C1206]
C10  10u  C-EUC1206  [C1206]
C11  10u  C-EUC1206  [C1206]
C12  100n  C-EUC0603  [C0603]
C13  10u  C-EUC1206  [C1206]
C14  10u  C-EUC1206  [C1206]
C21  47p  C-EUC0603  [C0603]
C22  1u  C-EUC0603  [C0603]
C23  100n  C-EUC0603  [C0603]
C24  1u  C-EUC0603  [C0603]
C25  100n  C-EUC0603  [C0603]
C26  100n  C-EUC0603  [C0603]
C27  1u  C-EUC0603  [C0603]
C157  10u  C-EUC1206  [C1206]
IC1  STSPIN32F0A  [VFQFPN48]
IC6  SN74LVC3G17DCT  743G17DCT  [DCT_R-PDSO-G8]
L1  120R  FB_0603  [L0603]
L6  120R  FB_0603  [L0603]
LED2  gr  LEDCHIP-LED0603  [CHIP-LED0603]
Q1  FDMD85100  NMOS_HBRIDGE  [POWER56_HBRIDGE]
Q2  FDMD85100  NMOS_HBRIDGE  [POWER56_HBRIDGE]
Q3  FDMD85100  NMOS_HBRIDGE  [POWER56_HBRIDGE]
Q5  KC2016K4.00000C1GE00  OSCIKC2016  [OSCI-KC2016]
R1  33  R-EU_R0603  [R0603]
R2  33  R-EU_R0603  [R0603]
R3  33  R-EU_R0603  [R0603]
R4  33  R-EU_R0603  [R0603]
R5  33  R-EU_R0603  [R0603]
R6  33  R-EU_R0603  [R0603]
R9  1k  R-EU_R0603  [R0603]
R16  0R025  R-EU_R1206  [R1206]
R17  1k33 1%  R-EU_R0603  [R0603]
R18  1k33 1%  R-EU_R0603  [R0603]
R19  7k32 1%  R-EU_R0603  [R0603]
R20  16k2 1%  R-EU_R0603  [R0603]
R22  243k 1%  R-EU_R0603  [R0603]
R23  24k 1%  R-EU_R0603  [R0603]
RN1  100  4R-NEXB28V  [EXB28V]
RN6  100  4R-NEXB28V  [EXB28V]
SWCLK  TPTP10R  [TP10R]
SWDIO  TPTP10R  [TP10R]
X1  640454-8  MTA-100-8  [640454-8]

### Nets
+3V3: C4.1 C25.1 IC1.9(PWR:SW) IC1.48(PWR:VDD) IC6.8(P:VCC) L1.2 L6.2 Q5.1(OE) Q5.4(VCC) R9.2
+5V: X1.8
BOOT: IC1.42(PWR:BOOT0)
GND: C4.2 C5.2 C6.2 C7.2 C8.2 C9.2 C10.2 C11.2 C12.2 C13.2 C14.2 C21.2 C22.2 C23.2 C24.2 C25.2 C26.2 C27.2 C157.2 IC1.20(PWR:TESTMODE) IC1.44(PWR:GND) IC1.45(OP3:+IN) IC1.46(OP3:-IN) IC1.PAD(PWR:EPAD) IC6.4(P:GND) Q5.2(GND) R16.1 R18.1 R23.1 X1.4
M1-CUR: IC1.15(IO:PA4) IC1.21(OP1:OUT) R19.1
M1-H1: IC6.3(B:I) X1.6
M1-H2: IC6.6(C:I) X1.5
M1-H3: IC6.1(A:I) X1.7
M1-LED: IC1.41(IO:PB7) LED2.C
M1-TIM2-CH1: IC1.11(IO:PA0) RN1.4
M1-TIM2-CH2: IC1.12(IO:PA1) RN1.3
M1-TIM2-CH3: IC1.13(IO:PA2) RN1.2
M1-VOL: IC1.2(OP2:-IN) IC1.3(OP2:OUT) IC1.14(IO:PA3)
MGND: Q1.S2 Q2.S2 Q3.S2 R16.2 R17.2
N$1: C1.2 IC1.34(MOT:OUTU) Q1.2(GR)
N$2: C3.2 IC1.26(MOT:OUTW) Q3.2(GR)
N$3: C2.2 IC1.30(MOT:OUTV) Q2.2(GR)
N$4: Q2.1(G1) R3.2
N$5: Q2.8(G2) R4.2
N$6: Q3.1(G1) R5.2
N$7: Q3.8(G2) R6.2
N$8: Q1.8(G2) R2.2
N$9: Q1.1(G1) R1.2
N$10: IC1.33(MOT:HSU) R1.1
N$11: IC1.36(MOT:LSU) R2.1
N$12: IC1.29(MOT:HSV) R3.1
N$13: IC1.32(MOT:LSV) R4.1
N$14: IC1.25(MOT:HSW) R5.1
N$15: IC1.28(MOT:LSW) R6.1
N$16: C1.1 IC1.35(MOT:VBOOTU)
N$17: C2.1 IC1.31(MOT:VBOOTV)
N$18: C3.1 IC1.27(MOT:VBOOTW)
N$19: Q1.5(S1/D2) Q1.6(S1/D2) Q1.7(S1/D2) X1.1
N$20: Q2.5(S1/D2) Q2.6(S1/D2) Q2.7(S1/D2) X1.2
N$21: Q3.5(S1/D2) Q3.6(S1/D2) Q3.7(S1/D2) X1.3
N$23: IC6.5(B:O) RN1.5
N$24: IC6.2(C:O) RN1.6
N$25: IC6.7(A:O) RN1.7
N$27: C12.1 L1.1 R20.2
N$29: LED2.A R9.1
N$31: IC1.39(IO:PA15) RN6.1
N$35: C26.1 IC1.10(PWR:VDDA) L6.1
N$39: IC1.22(OP1:-IN) R18.2 R19.2
N$40: C21.1 IC1.23(OP1:+IN) IC1.24(MOT:OC_COMP) R17.1 R20.1
N$43: C24.1 IC1.6(PWR:VREG12V)
N$45: C27.1 IC1.1(OP2:+IN) R22.1 R23.2
N$47: IC1.4(IO:PF0) Q5.3(FO)
SRST: C23.1 IC1.7(PWR:NRST)
SWCLK: IC1.38(IO:PA14_SWD_CLK) RN6.4 SWCLK.TP
SWDIO: IC1.37(IO:PA13_SWD_IO) SWDIO.TP
USART1-RX: RN6.8
USART1-TX: RN6.5
VCC: C5.1 C6.1 C7.1 C8.1 C9.1 C10.1 C11.1 C13.1 C14.1 C22.1 C157.1 IC1.8(PWR:VM) Q1.3(D1) Q1.4(D1) Q1.D1 Q2.3(D1) Q2.4(D1) Q2.D1 Q3.3(D1) Q3.4(D1) Q3.D1 R22.2
Unconnected: IC1.5(IO:PF1) IC1.16(IO:PA5) IC1.17(IO:PA6) IC1.18(IO:PA7) IC1.19(IO:PB1) IC1.40(IO:PB6) IC1.47(OP3:OUT) RN1.1 RN1.8 RN6.2 RN6.3 RN6.6 RN6.7

### Notes on the sheet
- OC Threshold: 0.5V / 10.82A
- U_bias: 0.2504V
- A: 6.50376
- f_LP: 2547kHz
- Shunt Signal: 0.231V @ 10A
- Design: A. Ryll
- Dribbler Motor
- 3.3V @ 36.7125V VCC
- Maximum duty cycle: 96%
  C_boot ripple: 4%
  Gate t_switch: 89ns
  Gate I_max: ~350mA

### Library data of the parts
C1-C4 C12 C21-C27 = rcl:C-EU: CAPACITOR, European symbol; SPICEPREFIX: C
C5-C11 C13 C14 C157 = rcl:C-EU: CAPACITOR, European symbol; PARTNR: C3225X5R1H106M250AB; SPICEPREFIX: C; VMAX: 50V
IC1 = TIGERs:STSPIN32F0A
IC6 = TIGERs:74*3G17
L1 L6 = rc-master-smd:FB_: FERRITE BEAD
LED2 = led:LED: LED OSRAM: - CHIPLED LG R971, LG N971, LY N971, LG Q971, LY Q971, LO R971, LY R971 LH N974, LH R974 LS Q976, LO Q976, LY Q976 LO Q996 - Hyper CHIPLED LW Q18S LB Q993, LB Q99A, LB R99A - SideLED LS A670, LO A670, LY A670, LG A670, LP A670 LB A673, LV A673, LT A673, LW A673 LH A674 LY A675 LS A676, LA A676, LO A676, LY A676, LW A676 LS A679, LY A679, LG A679 - Hyper Micro SIDELED® LS Y876, LA Y876, LO Y876, LY Y876 LT Y87S - SmartLED LW L88C, LW L88S LB L89C, LB L89S, LG L890 LS L89K, LO L89K, LY L89K LS L896, LA L896, LO L896, LY L896 - TOPLED LS T670, LO T670, LY T670, LG T670, LP T670 LSG T670, LSP T670, LSY T670, LOP T670, LYG T670 LG T671, LOG T671, LSG T671 LB T673, LV T673, LT T673, LW T673 LH T674 LS T676, LA T676, LO T676, LY T676, LB T676, LH T676, LSB T676, LW T676 LB T67C, LV T67C, LT T67C, LS T67K, LO T67K, LY T67K, LW E67C LS E67B, LA E67B, LO E67B, LY E67B, LB E67C, LV E67C, LT E67C LW T67C LS T679, LY T679, LG T679 LS T770, LO T770, LY T770, LG T770, LP T770 LB T773, LV T773, LT T773, LW T773 LH T774 LS E675, LA E675, LY E675, LS T675 LS T776, LA T776, LO T776, LY T776, LB T776 LHGB T686 LT T68C, LB T68C - Hyper Mini TOPLED® LB M676 - Mini TOPLED Santana® LG M470 LS M47K, LO M47K, LY M47K Source: http://www.osram.convergy.de LUXEON: - LUMILED® LXK2-PW12-R00, LXK2-PW12-S00, LXK2-PW14-U00, LXK2-PW14-V00 LXK2-PM12-R00, LXK2-PM12-S00, LXK2-PM14-U00 LXK2-PE12-Q00, LXK2-PE12-R00, LXK2-PE12-S00, LXK2-PE14-T00, LXK2-PE14-U00 LXK2-PB12-K00, LXK2-PB12-L00, LXK2-PB12-M00, LXK2-PB14-N00, LXK2-PB14-P00, LXK2-PB14-Q00 LXK2-PR12-L00, LXK2-PR12-M00, LXK2-PR14-Q00, LXK2-PR14-R00 LXK2-PD12-Q00, LXK2-PD12-R00, LXK2-PD12-S00 LXK2-PH12-R00, LXK2-PH12-S00 LXK2-PL12-P00, LXK2-PL12-Q00, LXK2-PL12-R00 Source: www.luxeon.com KINGBRIGHT: KA-3528ASYC Source: www.kingbright.com; SPICEPREFIX: D
Q1-Q3 = TIGERs:NMOS_HBRIDGE
Q5 = TIGERs:OSCI
R1-R6 R9 R17-R20 R22 R23 = rcl:R-EU_: RESISTOR, European symbol; SPICEPREFIX: R
R16 = rcl:R-EU_: RESISTOR, European symbol; POWER: 1W; SPICEPREFIX: R
RN1 RN6 = resistor-dil:4R-N: Array Chip Resistor Source: RS Component / Phycomp; OC_FARNELL: unknown; OC_NEWARK: unknown
SWCLK SWDIO = testpad:TP: Test pad
X1 = TIGERs:MTA-100-8